# Altium schematic sheet WL-FPGA.SchDoc
size 594 x 420 mm; DocumentNumber: ТРАНСИВЕР «ВОЛК»; SheetNumber: 3; SheetTotal: 3
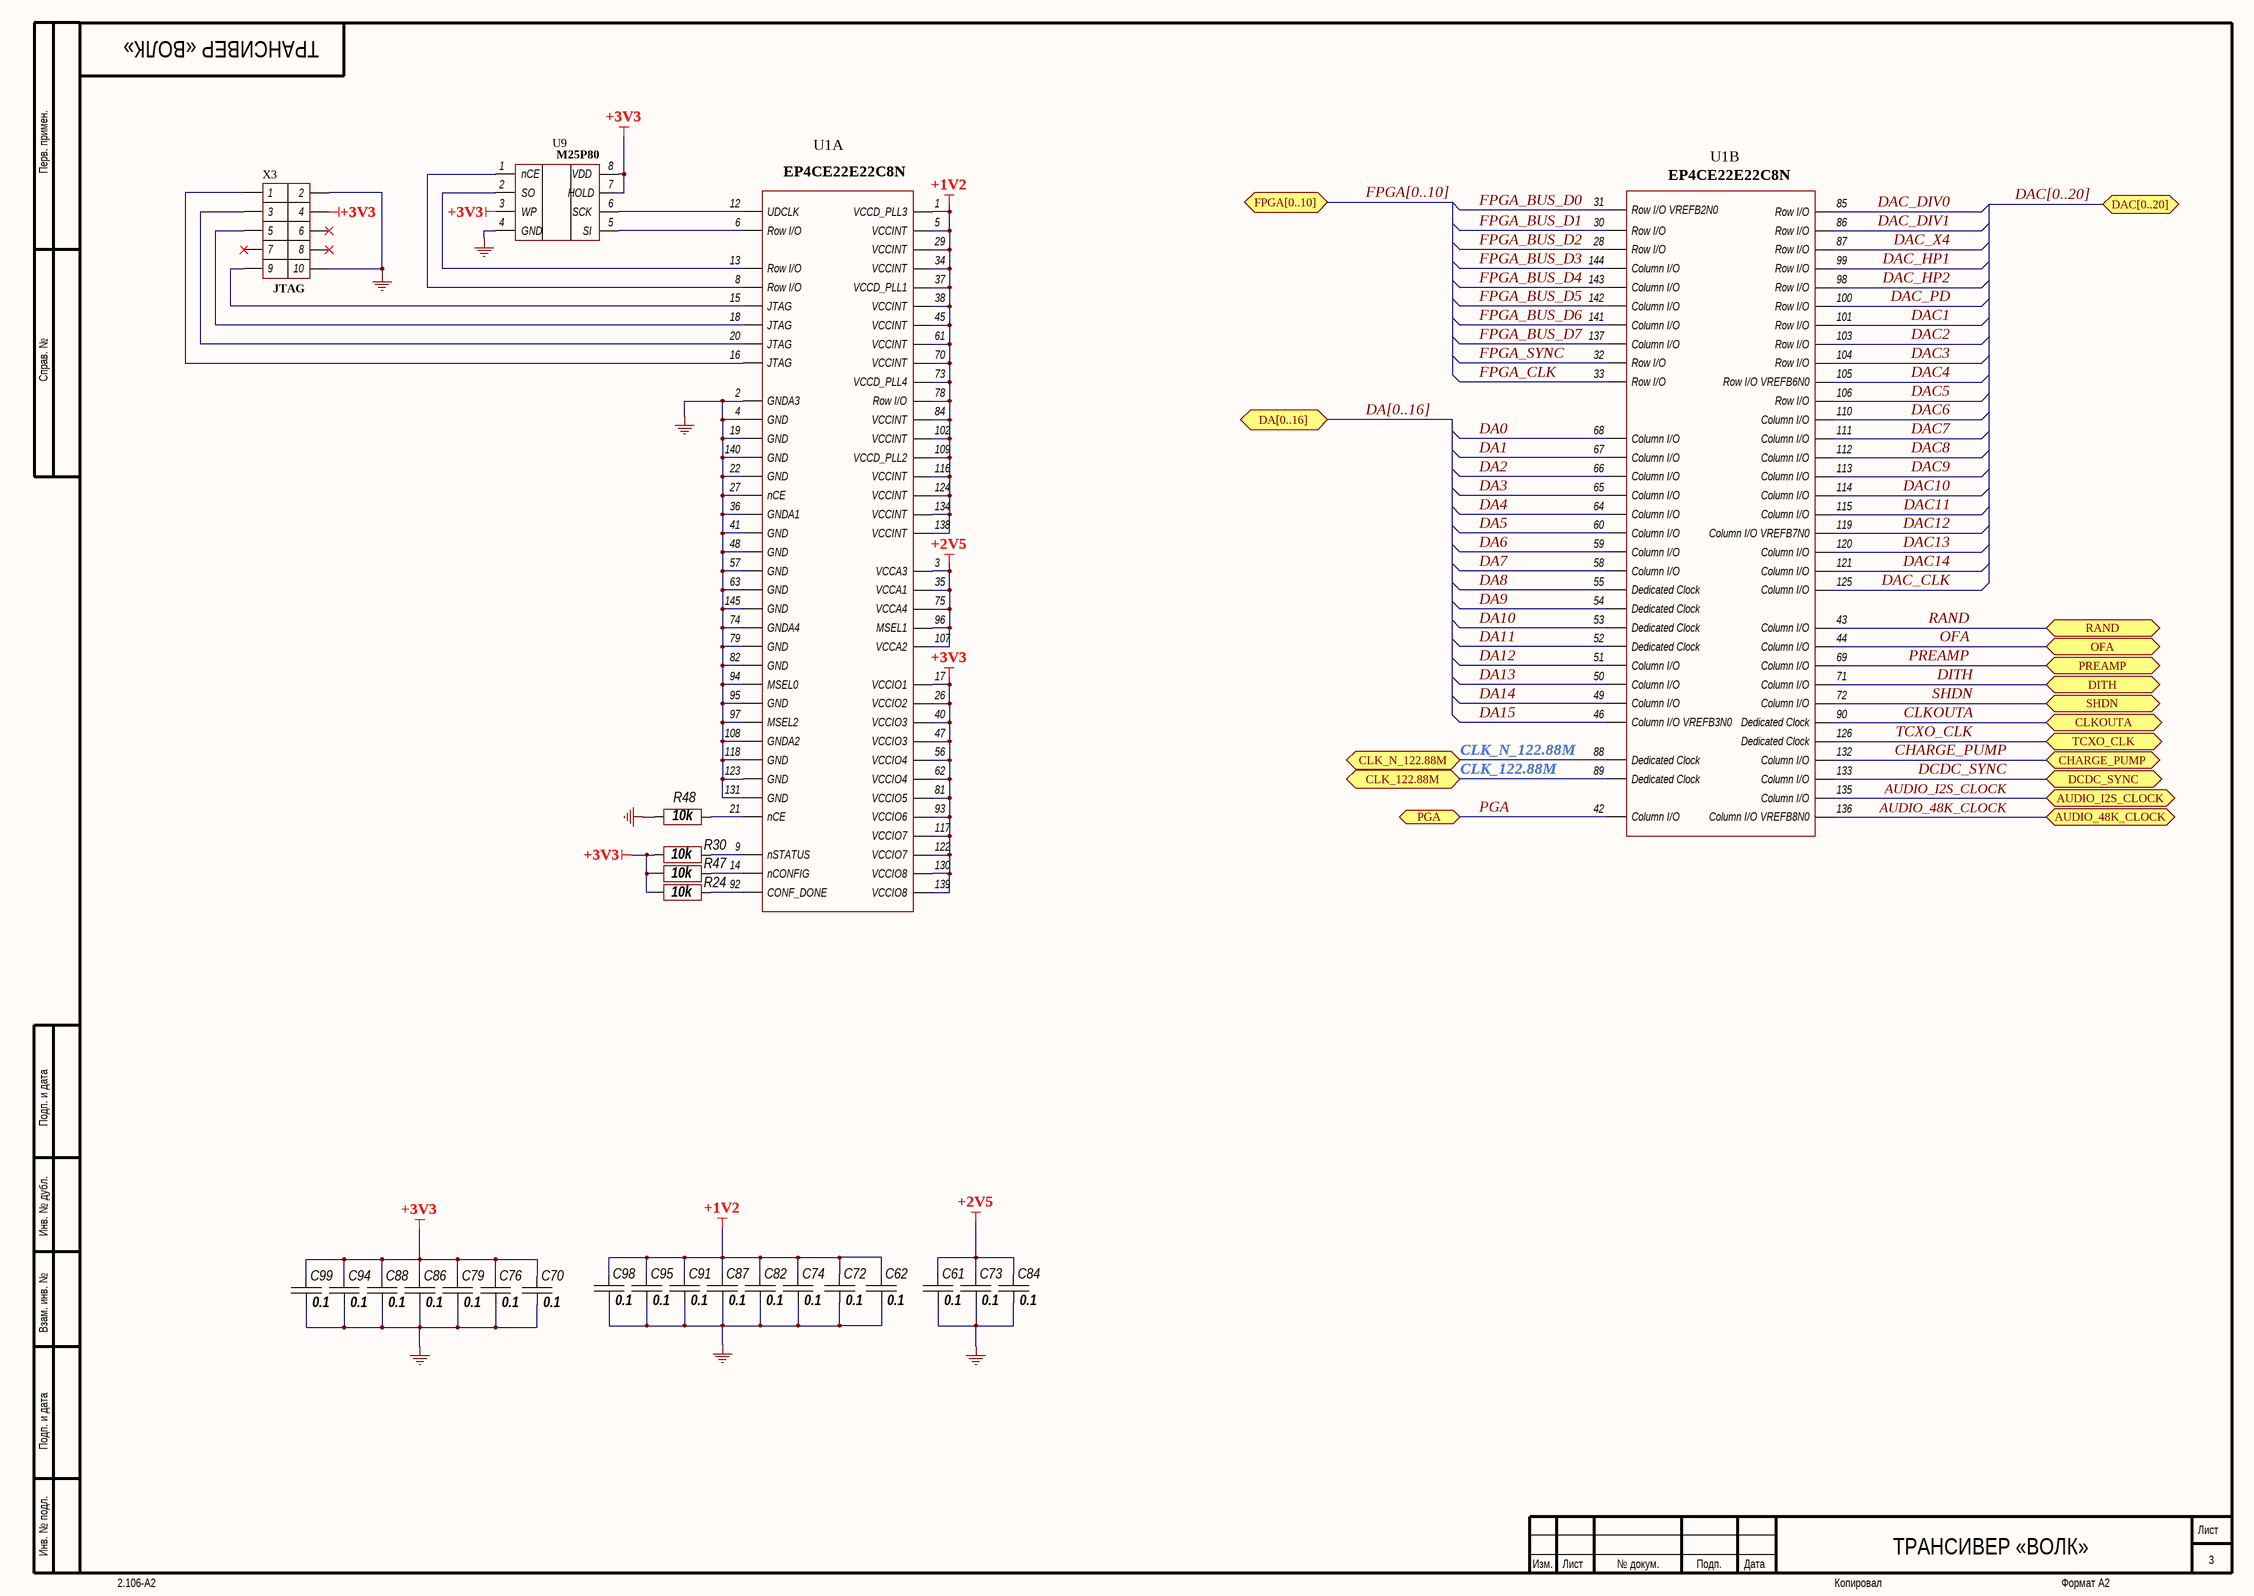
[diagram p0: WL-FPGA.SchDoc]

## Parts
C61  0.1  [CH0805C]
C62  0.1  [CH0805C]
C70  0.1  [CH0805C]
C72  0.1  [CH0805C]
C73  0.1  [CH0805C]
C74  0.1  [CH0805C]
C76  0.1  [CH0805C]
C79  0.1  [CH0805C]
C82  0.1  [CH0805C]
C84  0.1  [CH0805C]
C86  0.1  [CH0805C]
C87  0.1  [CH0805C]
C88  0.1  [CH0805C]
C91  0.1  [CH0805C]
C94  0.1  [CH0805C]
C95  0.1  [CH0805C]
C98  0.1  [CH0805C]
C99  0.1  [CH0805C]
R24  10k  [CH0805R]
R30  10k  [CH0805R]
R47  10k  [CH0805R]
R48  10k  [CH0805R]
U1  EP4CE22E22C8N  [144-QFN]  (parts A,B of 3)
U9  M25P80  [8-SOIC]
X3  JTAG  [CON: PLD-10]

## Ports
AUDIO_48K_CLOCK (bidir), AUDIO_I2S_CLOCK (bidir), CHARGE_PUMP (bidir), CLK_122.88M (bidir), CLK_N_122.88M (bidir), CLKOUTA (bidir), DA[0..16] (bidir), DAC[0..20] (bidir), DCDC_SYNC (bidir), DITH (bidir), FPGA[0..10] (bidir), OFA (bidir), PGA (bidir), PREAMP (bidir), RAND (bidir), SHDN (bidir), TCXO_CLK (bidir)

## Nets
+1V2: C62.2 C72.2 C74.2 C82.2 C87.2 C91.2 C95.2 C98.2 U1.1(VCCD_PLL3) U1.5(VCCINT) U1.29(VCCINT) U1.34(VCCINT) U1.37(VCCD_PLL1) U1.38(VCCINT) U1.45(VCCINT) U1.61(VCCINT) U1.70(VCCINT) U1.73(VCCD_PLL4) U1.78(Row_I/O) U1.84(VCCINT) U1.102(VCCINT) U1.109(VCCD_PLL2) U1.116(VCCINT) U1.124(VCCINT) U1.134(VCCINT) U1.138(VCCINT)
+2V5: C61.2 C73.2 C84.2 U1.3(VCCA3) U1.35(VCCA1) U1.75(VCCA4) U1.96(MSEL1) U1.107(VCCA2)
+3V3: C70.2 C76.2 C79.2 C86.2 C88.2 C94.2 C99.2 R24.2 R30.2 R47.2 U1.17(VCCIO1) U1.26(VCCIO2) U1.40(VCCIO3) U1.47(VCCIO3) U1.56(VCCIO4) U1.62(VCCIO4) U1.81(VCCIO5) U1.93(VCCIO6) U1.117(VCCIO7) U1.122(VCCIO7) U1.130(VCCIO8) U1.139(VCCIO8) U9.3(WP) U9.7(HOLD) U9.8(VDD) X3.4
GND: C61.1 C62.1 C70.1 C72.1 C73.1 C74.1 C76.1 C79.1 C82.1 C84.1 C86.1 C87.1 C88.1 C91.1 C94.1 C95.1 C98.1 C99.1 R48.2 U1.2(GNDA3) U1.4(GND) U1.19(GND) U1.22(GND) U1.27(nCE) U1.36(GNDA1) U1.41(GND) U1.48(GND) U1.57(GND) U1.63(GND) U1.74(GNDA4) U1.79(GND) U1.82(GND) U1.94(MSEL0) U1.95(GND) U1.97(MSEL2) U1.108(GNDA2) U1.118(GND) U1.123(GND) U1.131(GND) U1.140(GND) U1.145(GND) U9.4(GND) X3.2 X3.10
AUDIO_48K_CLOCK: U1.136(Column_I/O_VREFB8N0) ; port AUDIO_48K_CLOCK
AUDIO_I2S_CLOCK: U1.135(Column_I/O) ; port AUDIO_I2S_CLOCK
CHARGE_PUMP: U1.132(Column_I/O) ; port CHARGE_PUMP
CLK_122.88M: U1.89(Dedicated_Clock) ; port CLK_122.88M
CLK_N_122.88M: U1.88(Dedicated_Clock) ; port CLK_N_122.88M
CLKOUTA: U1.90(Dedicated_Clock) ; port CLKOUTA
DA0: U1.68(Column_I/O)
DA1: U1.67(Column_I/O)
DA2: U1.66(Column_I/O)
DA3: U1.65(Column_I/O)
DA4: U1.64(Column_I/O)
DA5: U1.60(Column_I/O)
DA6: U1.59(Column_I/O)
DA7: U1.58(Column_I/O)
DA8: U1.55(Dedicated_Clock)
DA9: U1.54(Dedicated_Clock)
DA10: U1.53(Dedicated_Clock)
DA11: U1.52(Dedicated_Clock)
DA12: U1.51(Column_I/O)
DA13: U1.50(Column_I/O)
DA14: U1.49(Column_I/O)
DA15: U1.46(Column_I/O_VREFB3N0)
DAC1: U1.101(Row_I/O)
DAC2: U1.103(Row_I/O)
DAC3: U1.104(Row_I/O)
DAC4: U1.105(Row_I/O_VREFB6N0)
DAC5: U1.106(Row_I/O)
DAC6: U1.110(Column_I/O)
DAC7: U1.111(Column_I/O)
DAC8: U1.112(Column_I/O)
DAC9: U1.113(Column_I/O)
DAC10: U1.114(Column_I/O)
DAC11: U1.115(Column_I/O)
DAC12: U1.119(Column_I/O_VREFB7N0)
DAC13: U1.120(Column_I/O)
DAC14: U1.121(Column_I/O)
DAC_CLK: U1.125(Column_I/O)
DAC_DIV0: U1.85(Row_I/O)
DAC_DIV1: U1.86(Row_I/O)
DAC_HP1: U1.99(Row_I/O)
DAC_HP2: U1.98(Row_I/O)
DAC_PD: U1.100(Row_I/O)
DAC_X4: U1.87(Row_I/O)
DCDC_SYNC: U1.133(Column_I/O) ; port DCDC_SYNC
DITH: U1.71(Column_I/O) ; port DITH
FPGA_BUS_D0: U1.31(Row_I/O_VREFB2N0)
FPGA_BUS_D1: U1.30(Row_I/O)
FPGA_BUS_D2: U1.28(Row_I/O)
FPGA_BUS_D3: U1.144(Column_I/O)
FPGA_BUS_D4: U1.143(Column_I/O)
FPGA_BUS_D5: U1.142(Column_I/O)
FPGA_BUS_D6: U1.141(Column_I/O)
FPGA_BUS_D7: U1.137(Column_I/O)
FPGA_CLK: U1.33(Row_I/O)
FPGA_SYNC: U1.32(Row_I/O)
OFA: U1.44(Column_I/O) ; port OFA
PGA: U1.42(Column_I/O) ; port PGA
PREAMP: U1.69(Column_I/O) ; port PREAMP
RAND: U1.43(Column_I/O) ; port RAND
SHDN: U1.72(Column_I/O) ; port SHDN
TCXO_CLK: U1.126(Dedicated_Clock) ; port TCXO_CLK
NetR24_1: R24.1 U1.92(CONF_DONE)
NetR30_1: R30.1 U1.9(nSTATUS)
NetR47_1: R47.1 U1.14(nCONFIG)
NetR48_1: R48.1 U1.21(nCE)
NetU1_6: U1.6(Row_I/O) U9.5(SI)
NetU1_8: U1.8(Row_I/O) U9.1(nCE)
NetU1_12: U1.12(UDCLK) U9.6(SCK)
NetU1_13: U1.13(Row_I/O) U9.2(SO)
NetU1_15: U1.15(JTAG) X3.9
NetU1_16: U1.16(JTAG) X3.1
NetU1_18: U1.18(JTAG) X3.5
NetU1_20: U1.20(JTAG) X3.3

Not connected (* = marked no-connect by the designer): X3 6* 7* 8*

## Buses and harness runs
bus DA[0..16] = port DA[0..16]
bus DAC[0..20] = port DAC[0..20]
bus FPGA[0..10] = port FPGA[0..10]

## Notes on the sheet
- Перв. примен.
- Справ. №
- Подп. и дата
- Инв. № дубл.
- Взам. инв. №
- Инв. № подл.
- Изм.
- Лист
- № докум.
- Подп.
- Дата
- 2.106-A2
- Копировал
- Формат А2

## Library data of the parts
C61 C62 C70 C72-C74 C76 C79 C82 C84 C86-C88 C91 C94 C95 C98 C99 = Capacitor: Manufacturer: *; Model: *; HelpURL: *; ComponentKind: *; Value: *
R24 R30 R47 R48 = Resistor: Manufacturer: *; Model: *; HelpURL: *; ComponentKind: *; Value: *
U1 = EP4CE22E22C8N-№1